# EAGLE design QuantumDice (EAGLE 7.7.0)
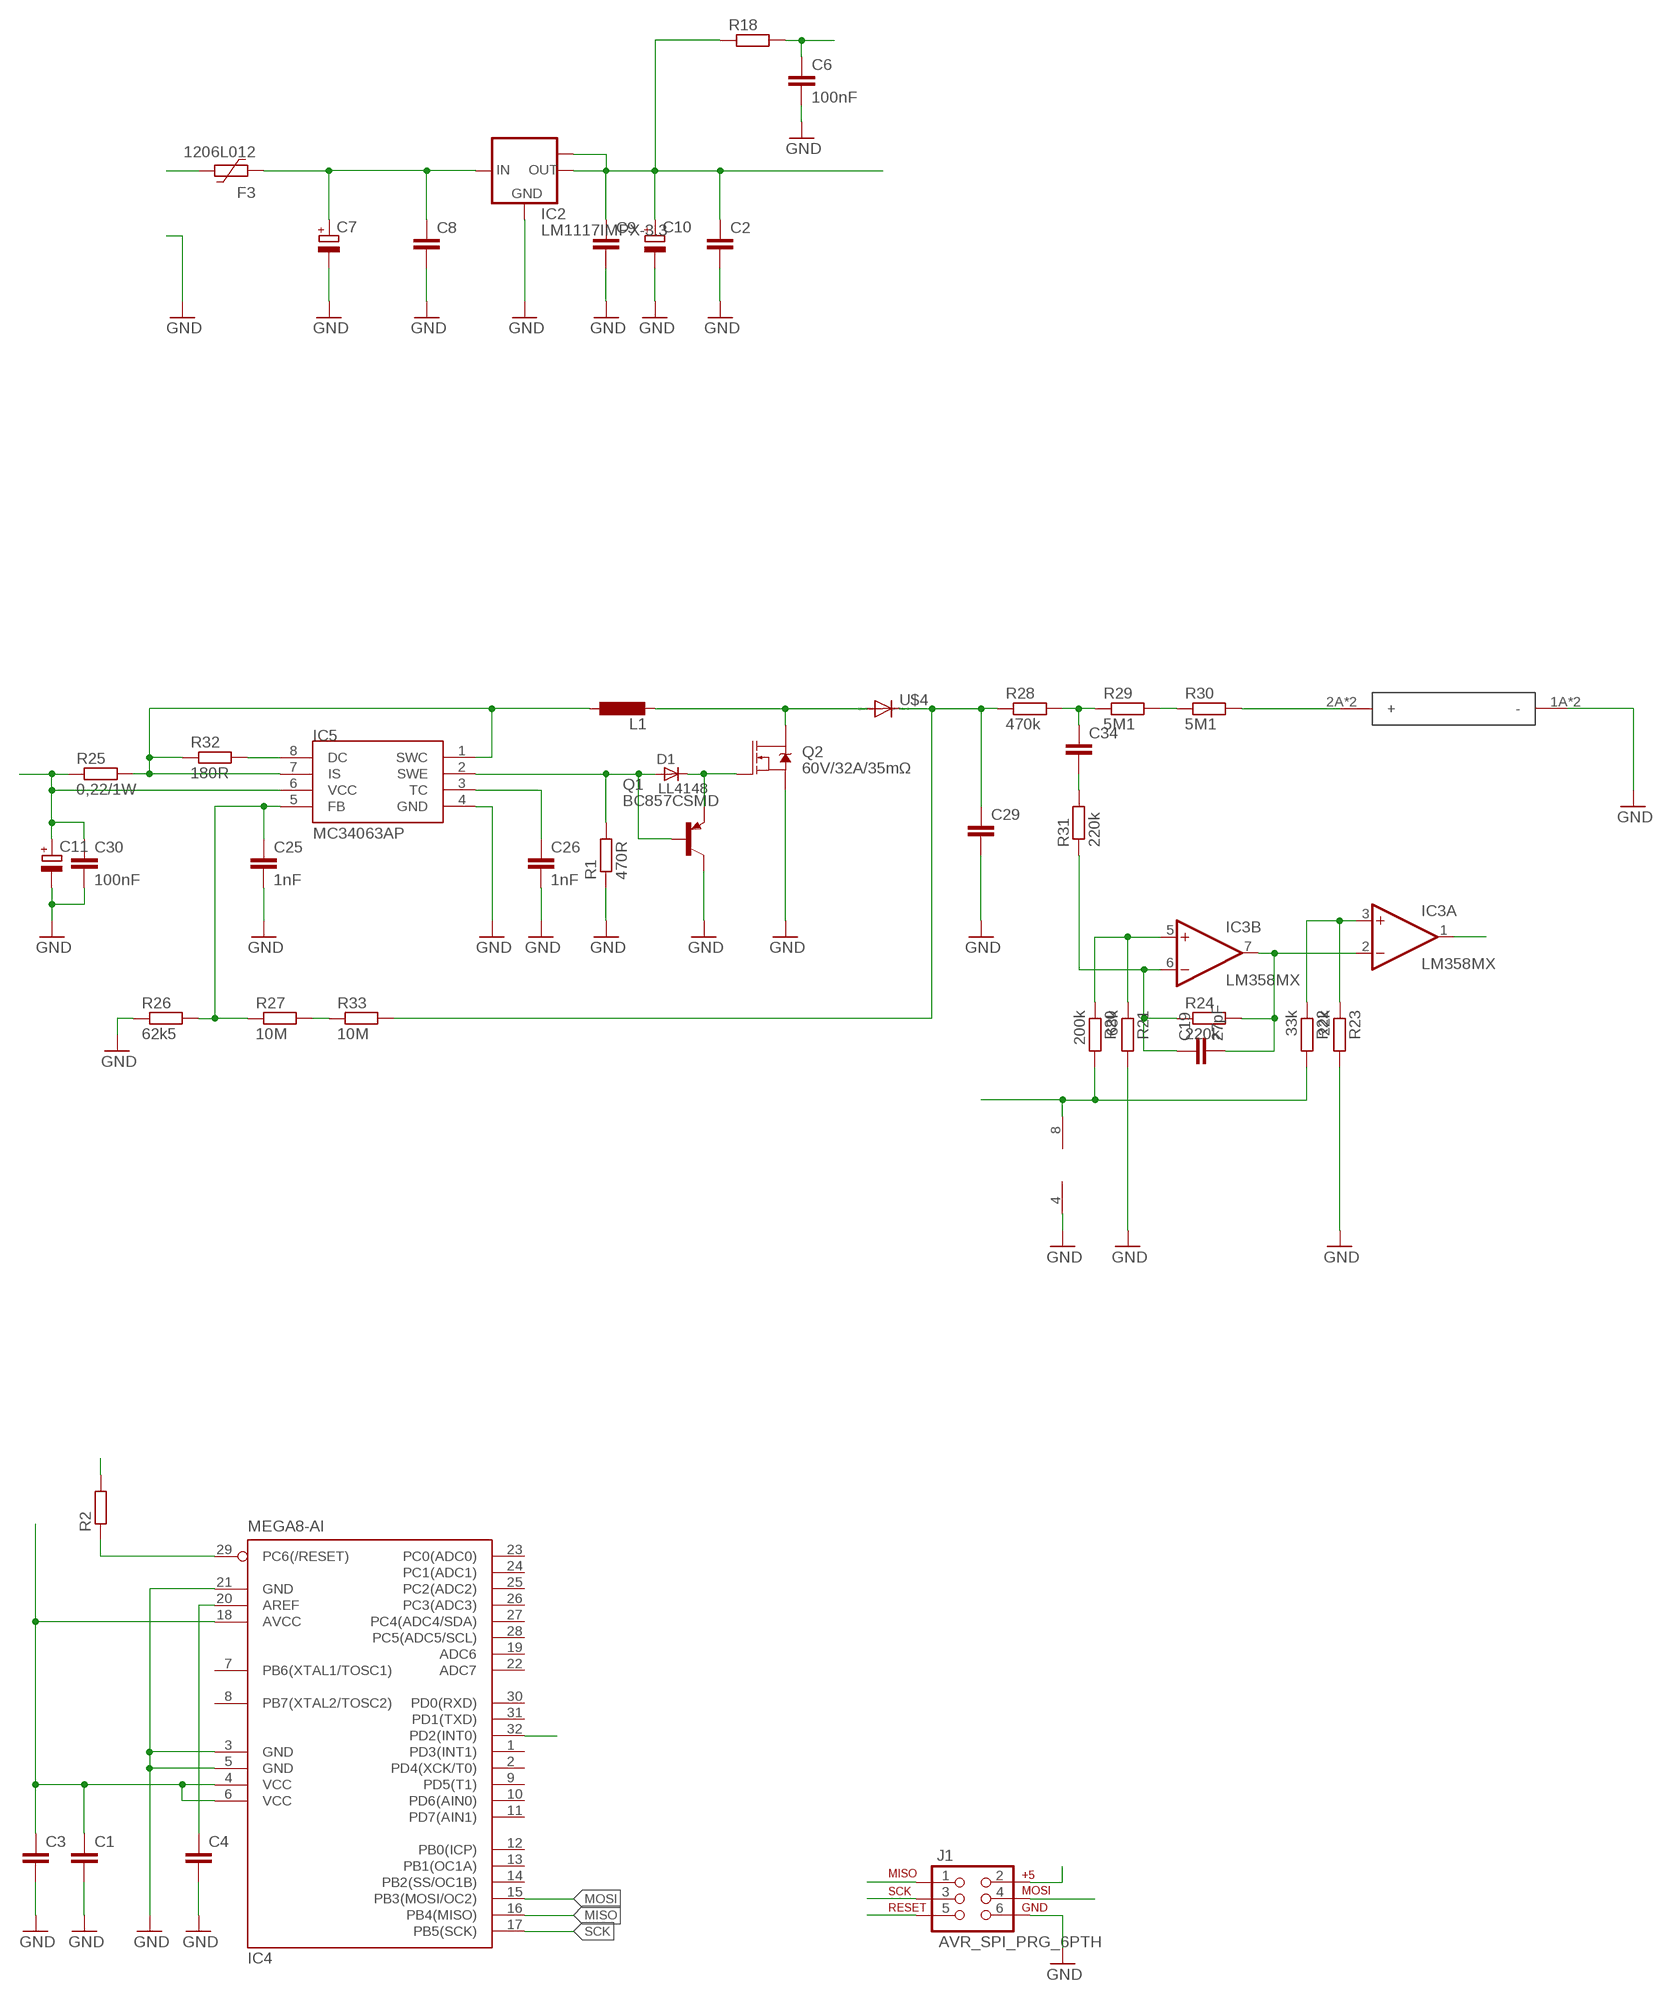
[diagram p0: schematic, sheet 1]

## Parts
C1  C-EUC0603  [C0603]
C2  C-EUC0603  [C0603]
C3  C-EUC0603  [C0603]
C4  C-EUC0603  [C0603]
C6  100nF  C-EUC0603  [C0603]
C7  CPOL-EUSMCC  [SMC_C]
C8  C-EUC1206  [C1206]
C9  C-EUC1206  [C1206]
C10  CPOL-EUSMCC  [SMC_C]
C11  CPOL-EUSMCE  [SMC_E]
C19  27pF  C-EUC0603  [C0603]
C25  1nF  C-EUC0603  [C0603]
C26  1nF  C-EUC0603  [C0603]
C29  C-EU225-113X268  [C225-113X268]
C30  100nF  C-EUC0603  [C0603]
C34  C-EU050-024X044  [C050-024X044]
D1  LL4148  [SOD80_DO213AA_MINIMELF]
F3  1206L012  [1206L]
IC2  LM1117IMPX-3.3  [SOT223]
IC3  LM358MX  [SO08]
IC4  MEGA8-AI  [TQFP32-08]
IC5  MC34063AP  [DIL08]
J1  AVR_SPI_PRG_6PTH  [2X3]
L1  L-EU6000-XXX-RC  [6000-XXXX-RC]
Q1  BC857CSMD  [SOT23-BEC]
Q2  60V/32A/35mΩ  MOSFET-NCH-FQP30N06L  [TO220V]
R1  470R  R-EU_R1206  [R1206]
R2  R-EU_R0603  [R0603]
R18  R-EU_R1206  [R1206]
R20  200k  R-EU_R0603  [R0603]
R21  68k  R-EU_R0603  [R0603]
R22  33k  R-EU_R1206  [R1206]
R23  22k  R-EU_R0603  [R0603]
R24  220k  R-EU_R0603  [R0603]
R25  0,22/1W  R-EU_R2010  [R2010]
R26  62k5  R-EU_R1206  [R1206]
R27  10M  R-EU_R2512  [R2512]
R28  470k  R-EU_R2512  [R2512]
R29  5M1  R-EU_R2512  [R2512]
R30  5M1  R-EU_R2512  [R2512]
R31  220k  R-EU_R0805  [R0805]
R32  180R  R-EU_R0805  [R0805]
R33  10M  R-EU_R2512  [R2512]
U$4  DIODE-MELF-MLL41  [MELF-MLL41]
U$5  STS5  [GEIGERTUBE]

## Nets
9V: C7.+ C8.1 C11.+ C30.1 F3.2 IC2.3(IN) IC5.6(VCC) R25.1
_5V: C1.1 C2.1 C3.1 C9.1 C10.+ IC2.2(OUT) IC2.TAB(OUT1) IC4.4(VCC) IC4.6(VCC) IC4.18(AVCC) J1.2 R2.2 R18.1
A_5V: C6.1 IC3.8(P:V+) R18.2 R20.2 R22.2
CPM: IC3.1(A:OUT) IC4.32(PD2(INT0))
GND: C1.2 C2.2 C3.2 C4.2 C6.2 C7.- C8.2 C9.2 C10.- C11.- C25.2 C26.2 C29.2 C30.2 IC2.1(GND) IC3.4(P:V-) IC4.3(GND) IC4.5(GND) IC4.21(GND) IC5.4(GND) J1.6 Q1.C Q2.3(S) R1.1 R21.2 R23.2 R26.1 U$5.1A(-) U$5.1B(-)
HV: C29.1 R28.1 R33.2 U$4.C
MISO: IC4.16(PB4(MISO)) J1.1
MOSI: IC4.15(PB3(MOSI/OC2)) J1.4
N$2: D1.A IC5.2(SWE) Q1.B R1.2
N$3: D1.C Q1.E Q2.1(G)
N$5: C19.1 IC3.6(B:-IN) R24.1 R31.1
N$6: C4.1 IC4.20(AREF)
N$8: C19.2 IC3.2(A:-IN) IC3.7(B:OUT) R24.2
N$11: C26.1 IC5.3(TC)
N$14: F3.1
N$19: IC3.5(B:+IN) R20.1 R21.1
N$20: IC3.3(A:+IN) R22.1 R23.1
N$21: L1.2 Q2.2(D) U$4.A
N$24: C25.1 IC5.5(FB) R26.2 R27.1
N$25: R30.2 U$5.2A(+) U$5.2B(+)
N$26: R29.2 R30.1
N$27: C34.1 R28.2 R29.1
N$28: C34.2 R31.2
N$33: IC5.1(SWC) IC5.7(IS) L1.1 R25.2 R32.1
N$34: IC5.8(DC) R32.2
N$35: R27.2 R33.1
RESET: IC4.29(PC6(/RESET)) J1.5 R2.1
SCK: IC4.17(PB5(SCK)) J1.3
Unconnected: IC4.1(PD3(INT1)) IC4.2(PD4(XCK/T0)) IC4.7(PB6(XTAL1/TOSC1)) IC4.8(PB7(XTAL2/TOSC2)) IC4.9(PD5(T1)) IC4.10(PD6(AIN0)) IC4.11(PD7(AIN1)) IC4.12(PB0(ICP)) IC4.13(PB1(OC1A)) IC4.14(PB2(SS/OC1B)) IC4.19(ADC6) IC4.22(ADC7) IC4.23(PC0(ADC0)) IC4.24(PC1(ADC1)) IC4.25(PC2(ADC2)) IC4.26(PC3(ADC3)) IC4.27(PC4(ADC4/SDA)) IC4.28(PC5(ADC5/SCL)) IC4.30(PD0(RXD)) IC4.31(PD1(TXD))

## Library data of the parts
C1-C4 C6 C8 C9 C19 C25 C26 C29 C30 C34 = rcl:C-EU: CAPACITOR, European symbol
C7 C10 C11 = rcl:CPOL-EU: POLARIZED CAPACITOR, European symbol
D1 = _hhn_diodes_smd:LL4148: 1N4148 General Purpose Rectifie SMD-Version of 1N4148 Case: SOD 80 = DO 213 AA = MINIMELF (Glass) Author: Dipl.-Ing. FH Rainer Bayer HHN Hochschule Heilbronn, rainer.bayer@hs-heilbronn.de Ingenieurbüro ing-rb, mail@ing-rb.de
F3 = polyfuse-smd_10:?: Polyfuse Resettable PTC Source: http://www.littelfuse.com/products/resettable-ptcs.aspx; MF: Littelfuse; MPN: 1206L012; OC_FARNELL: 1596988; OC_NEWARK: 05M2298
IC2 = lm1117:LM1117IMPX-*
IC3 = linear:LM358: OP AMP also LM158; LM258; LM2904 Source: http://cache.national.com/ds/LM/LM158.pdf
IC4 = atmel:MEGA8: MICROCONTROLLER 8 Kbytes FLASH, 1 kbytes SRAM, 512 bytes EEPROM, USART, 6-channel 10 bit ADC, 2-channel 8 bit ADC Pin compatible with Atmega48, ATMega88, ATMega168 Source: avr.lbr; MPN: ATMEGA8-16AU; OC_FARNELL: 9171371; OC_NEWARK: 73M8863
IC5 = mc34063:MC34063
J1 = SparkFun-Connectors:AVR_SPI_PRG_6: AVR ISP 6 Pin This is the reduced ISP connector for AVR programming. Common on Arduino. This footprint will take up less PCB space and can be used with a 10-pin to 6-pin adapter such as SKU: BOB-08508
L1 = rcl:L-EU: INDUCTOR, European symbol
Q1 = transistor-pnp:BC857*: PNP Transistror
Q2 = SparkFun-DiscreteSemi:MOSFET-NCH: N-channel MOSFETs Voltage controlled devices that allow control of high current outputs. SparkFun Products: SparkFun OpenScale <https://www.sparkfun.com/products/13261> SparkFun Digital Sandbox <https://www.sparkfun.com/products/12651> SparkFun Monster Moto Shield <https://www.sparkfun.com/products/10182> SparkFun MOSFET Power Controller <https://www.sparkfun.com/products/11214>; PROD_ID: TRANS-10060
R1 R2 R18 R20-R33 = rcl:R-EU_: RESISTOR, European symbol
U$4 = diode:DIODE-: DIODE
U$5 = mw:STS5

## Board
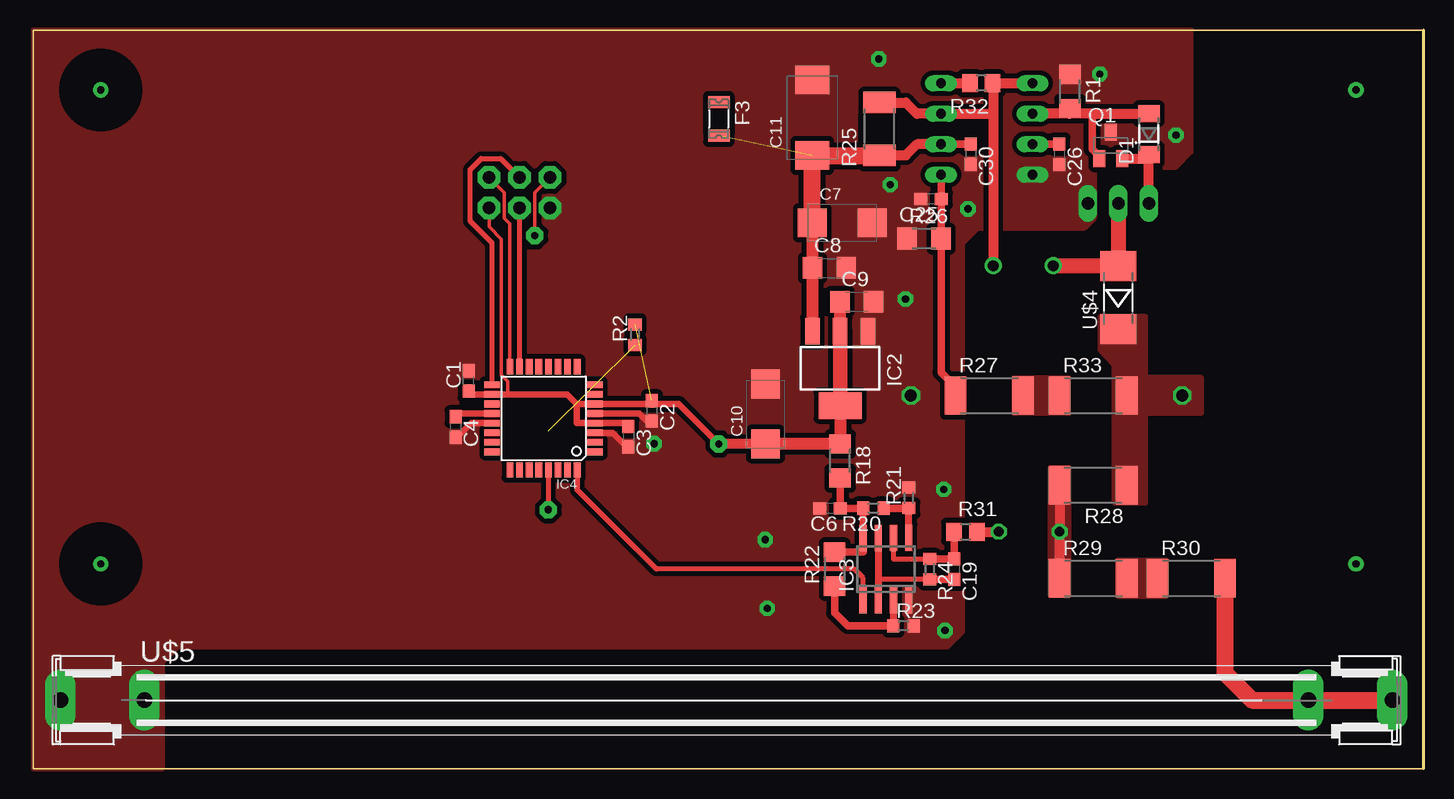
[diagram p1: board, top side]
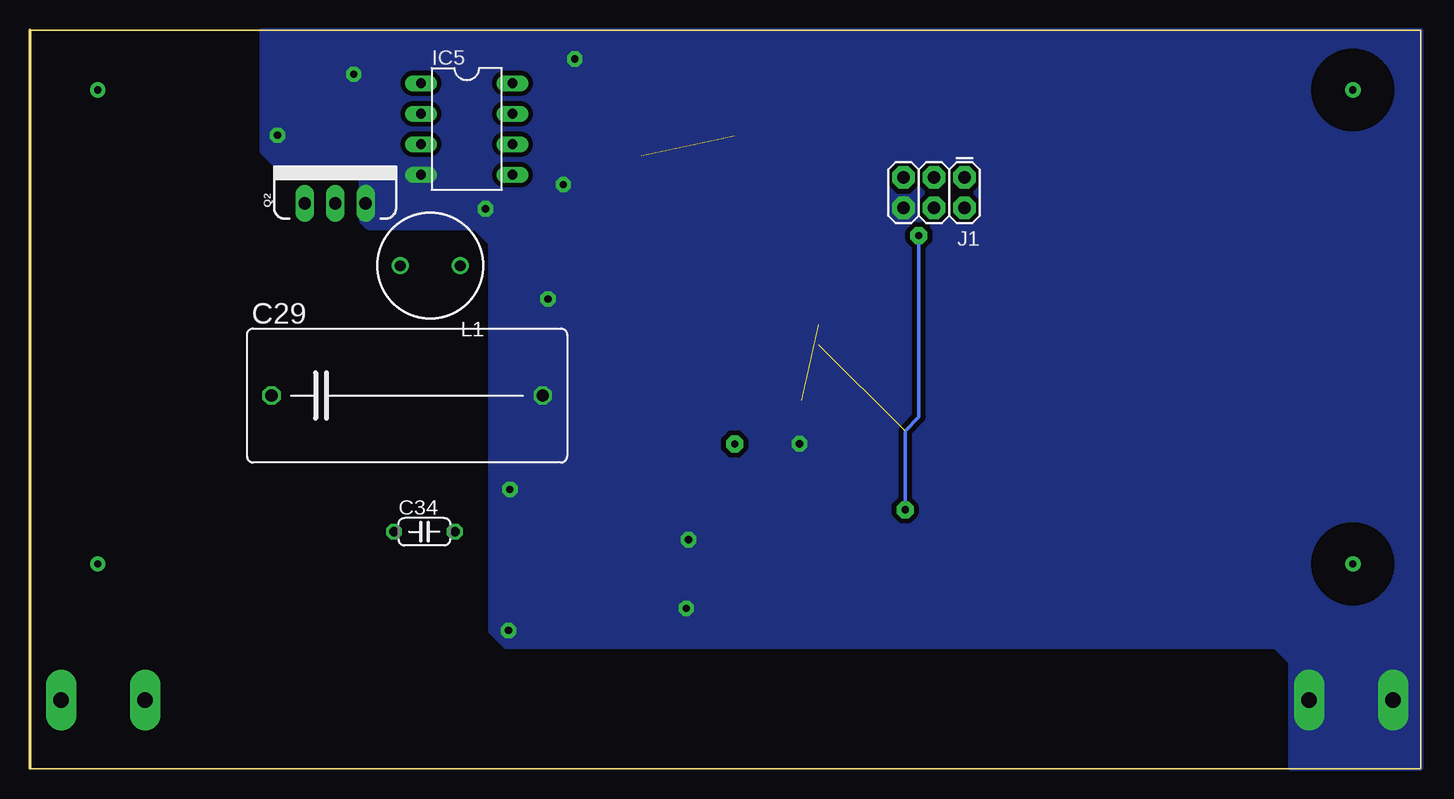
[diagram p2: board, bottom side, seen from below]

Size 115.88 x 61.6 mm. Coordinates in mm from the lower left corner, seen from the top.
Outline: 0,0 115.88,0 115.88,61.6 0,61.6 0,0
Copper layers (1*16): Top 0.035mm / dielectric 1.5mm / Bottom 0.035mm
Design rules "default *": minimum track width 10mil, minimum drill 24mil, track to track 8mil, track to pad 8mil, pad to pad 8mil, via to via 8mil, smd to smd 8mil, copper to edge 0mil, drill to drill 8mil, minimum pad ring 10mil, minimum via ring 8mil, stop-mask expansion 4mil, vias tented up to drill 0mil, thermal gap 10mil
tRestrict: area 2.6,14 to 8.7,20.1; area 2.6,53.5 to 8.7,59.6
bRestrict: area 2.6,14 to 8.7,20.1; area 2.6,53.5 to 8.7,59.6

### Footprints (pad centres in the part's own frame; a part is rotated, then mirrored left to right if it is on the bottom)
C0603 = smd 1.1 x 1: 1 -0.85,0; 2 0.85,0
SMC_C = smd 2.4 x 2.4: + -2.5,0; - 2.5,0
C1206 = smd 1.6 x 1.8: 1 -1.4,0; 2 1.4,0
SMC_E = smd 2.4 x 2.8: + -3.15,0; - 3.15,0
C225-113X268 = drill 1.016 octagon: 1 -11.303,0; 2 11.303,0
C050-024X044 = drill 0.813 octagon: 1 -2.54,0; 2 2.54,0
SOD80_DO213AA_MINIMELF = smd 1.4 x 1.8: A 1.7,0; C -1.7,0
1206L = smd 1 x 1.8: 1 -1.4,0; 2 1.4,0
SOT223 = smd 1.219 x 2.235: 1 -2.311,-3.099; 2 0,-3.099; 3 2.311,-3.099 | smd 3.6 x 2.2: TAB 0,3.099
SO08 = smd 0.6 x 2.2: 1 -1.905,-2.6; 2 -0.635,-2.6; 3 0.635,-2.6; 4 1.905,-2.6; 5 1.905,2.6; 6 0.635,2.6; 7 -0.635,2.6; 8 -1.905,2.6
TQFP32-08 = smd 1.27 x 0.559: 1 -4.293,2.8; 2 -4.293,2; 3 -4.293,1.2; 4 -4.293,0.4; 5 -4.293,-0.4; 6 -4.293,-1.2; 7 -4.293,-2; 8 -4.293,-2.8; 17 4.293,-2.8; 18 4.293,-2; 19 4.293,-1.2; 20 4.293,-0.4; 21 4.293,0.4; 22 4.293,1.2; 23 4.293,2; 24 4.293,2.8 | smd 0.559 x 1.27: 9 -2.8,-4.293; 10 -2,-4.293; 11 -1.2,-4.293; 12 -0.4,-4.293; 13 0.4,-4.293; 14 1.2,-4.293; 15 2,-4.293; 16 2.8,-4.293; 25 2.8,4.293; 26 2,4.293; 27 1.2,4.293; 28 0.4,4.293; 29 -0.4,4.293; 30 -1.2,4.293; 31 -2,4.293; 32 -2.8,4.293
DIL08 = drill 0.813 long: 1 -3.81,-3.81; 2 -1.27,-3.81; 3 1.27,-3.81; 4 3.81,-3.81; 5 3.81,3.81; 6 1.27,3.81; 7 -1.27,3.81; 8 -3.81,3.81
2X3 = drill 1.016 pad 1.88 octagon: 1 0,0; 2 0,2.54; 3 2.54,0; 4 2.54,2.54; 5 5.08,0; 6 5.08,2.54
6000-XXXX-RC = drill 0.9 pad 1.422: 1 -2.5,0; 2 2.5,0
SOT23-BEC = smd 1 x 1.4: B -0.95,-1.1; C 0,1.1; E 0.95,-1.1
TO220V = drill 1.016 long: 1 -2.54,0; 2 0,0; 3 2.54,0
R1206 = smd 1.6 x 1.803: 1 -1.422,0; 2 1.422,0
R0603 = smd 1 x 1.1: 1 -0.85,0; 2 0.85,0
R2010 = smd 1.8 x 2.7: 1 -2.2,0; 2 2.2,0
R2512 = smd 1.8 x 3.2: 1 -2.8,0; 2 2.8,0
R0805 = smd 1.3 x 1.5: 1 -0.95,0; 2 0.95,0
MELF-MLL41 = smd 2.5 x 3: A 2.625,0; C -2.625,0
GEIGERTUBE = drill 1.321 pad 2.54 long: 1A -10.414,0; 1B -3.414,0; 2A 93.586,0; 2B 100.586,0

### Placement (x,y rotation side)
C1  36.3,32.33 90 top
C2  51.56,29.83 270 top
C3  49.61,27.69 270 top
C4  35.2,28.49 270 top
C6  66.42,21.72 180 top
C7  67.44,45.52 0 top
C8  66.36,41.76 0 top
C9  68.64,38.94 0 top
C10  61.04,29.57 90 top
C11  64.94,54.28 90 top
C19  76.76,16.64 270 top
C25  74.83,47.5 180 top
C26  85.52,51.22 270 top
C29  84.45,31.11 0 bottom
C30  78.13,51.23 270 top
C34  83.01,19.76 0 bottom
D1  92.99,52.91 90 top
F3  57.15,54.18 270 top
IC2  67.26,33.38 180 top
IC3  71.07,16.64 0 top
IC4  42.55,29.21 180 top
IC5  79.48,53.34 270 bottom
J1  38,49.3 180 bottom
L1  82.52,41.94 180 bottom
Q1  89.81,51.97 0 top
Q2  90.45,47.14 0 bottom
R1  86.41,56.46 270 top
R2  50.17,36.2 90 top
R18  67.26,25.65 270 top
R20  70.03,21.72 180 top
R21  72.97,22.58 90 top
R22  66.8,16.64 90 top
R23  72.54,11.91 0 top
R24  74.73,16.64 270 top
R25  70.54,53.34 90 top
R26  74.24,44.2 0 top
R27  79.68,31.11 0 top
R28  88.34,23.62 180 top
R29  88.34,15.88 0 top
R30  96.52,15.88 0 top
R31  77.7,19.76 0 top
R32  79.02,57.15 180 top
R33  88.34,31.11 0 top
U$4  90.42,39.27 90 top
U$5  12.7,5.71 0 top

### Tracks (layer width: path | path; a pad name or v marks a point on that pad's centre or on a via)
9V  (1 unrouted)
  Top 0.61: IC2.3 | IC5.6 C30.1
  Top 0.813: IC5.6 73.66,52.07 72.73,51.14 R25.1 | 64.94,36.49 IC2.3
  Top 1.016: C7.+ 64.94,41.91 | 64.94,41.91 64.94,36.48 IC2.3 | C8.1 64.96,41.89 64.94,41.91
  Top 1.422: 65.39,51.14 C11.+ | C11.+ 70.53,51.13 R25.1 | C7.+ C11.+
_5V  (via drill 0.6 pad 1.42)  (1 unrouted)
  Top 0.305: 39.54,31.21 39.54,32.29 39.01,32.82 39.01,44.17 38,45.19 J1.2
  Top 0.559: C1.1 36.3,31.21 IC4.18 39.54,31.21 44.51,31.21 45.31,30.41 | C3.1 49.61,28.81 IC4.4 45.31,28.81 45.31,30.41 | 45.31,30.41 IC4.6 51.56,30.41 | 51.56,30.41 C2.1 | 51.56,30.41 53.82,30.41 v57.15,27.08
  Top 0.61: IC2.TAB
  Top 0.813: C10.+ v57.15,27.08
  Top 1.016: IC2.TAB R18.1 C10.+ | IC2.2 67.26,38.92 C9.1
  Top 1.219: IC2.TAB IC2.2
  Top 1.27: IC2.TAB
A_5V
  Top 0.599: IC3.8 69.16,21.7 R20.2
  Top 0.61: R18.2 67.26,21.73 C6.1 R20.2 | R22.2 69.16,18.06 IC3.8
CPM
  Top 0.305: IC3.1
  Top 0.406: IC3.1 69.16,15.9 68.43,16.64 51.94,16.64 45.35,23.23 IC4.32
GND  (via drill 0.6 pad 1.27)
  Top 0.559: C4.2 35.34,27.64 36.51,28.81 IC4.21 | IC4.3 48.29,28.01 49.46,26.84 C3.2 | IC4.5 50.53,29.61 51.15,28.98 C2.2
  other vias: 61.19,13.38 61.01,19.09 71.44,48.69 70.48,59.18 76,11.52 95.25,52.83 77.92,46.69 88.9,57.91 72.71,39.17 75.88,23.29 51.75,27.1
  pour Top (isolate 0.406, rank 2, no thermals): 0,61.6 0,0 10.79,0 10.79,8.89 12.06,10.16 76.2,10.16 77.47,11.43 77.47,43.82 78.74,45.09 87.63,45.09 88.47,45.92 88.47,50.17 95.25,50.17 96.52,51.44 96.52,61.6
  pour Bottom (isolate 0.406, no thermals): 0,61.6 0,0 10.79,0 10.79,8.89 12.06,10.16 76.2,10.16 77.47,11.43 77.47,43.82 78.74,45.09 87.63,45.09 88.27,45.72 88.27,49.53 88.9,50.17 95.25,50.17 96.52,51.44 96.52,61.6
HV
  pour Top (isolate 0.406, no thermals): 97.38,32.61 92.74,32.61 92.74,37.69 88.9,37.69 88.9,34.93 90.07,33.66 90.07,22.17 92.74,22.17 92.74,29.64 97.38,29.64
MISO
  Top 0.305: IC4.16 39.75,45.45 39.27,45.92 39.27,48.03 J1.1
MOSI
  Top 0.406: IC4.15 J1.4
N$1
  cutout Top: 55.84,56.08 55.84,52.91 58.46,52.91 58.46,56.08
N$2
  Top 0.406: Q1.B 88.86,51.06
  Top 0.61: 88.86,51.06 88.27,51.66 88.27,54.61
  Top 0.813: D1.A 88.27,54.61 86.36,54.61 | 86.36,54.61 IC5.2 | IC5.2 | R1.2 86.41,54.66 86.36,54.61
N$3
  Top 0.61: 92.98,50.87 D1.C
  Top 0.813: Q2.1 D1.C 92.65,50.87 Q1.E
N$5
  Top 0.406: IC3.6 71.7,17.49 R24.1
  Top 0.61: R24.1 C19.1 R31.1
N$6
  Top 0.559: IC4.20 35.2,29.61 C4.1
N$8
  Top 0.406: R24.2 70.43,15.79
  Top 0.599: IC3.7 70.43,15.79 IC3.2
  Top 0.61: C19.2 R24.2
N$11
  Top 0.61: IC5.3 C26.1
N$14
  Top 0.399: 57.13,55.6 F3.1
  Top 0.813: 57.25,55.58 F3.1
N$19
  Top 0.599: IC3.5 R21.1
  Top 0.61: R20.1 72.96,21.72 R21.1
N$20
  Top 0.599: IC3.3 71.7,11.92 R23.1
  Top 0.61: R23.1 67.89,11.91 66.8,13 R22.1
N$21
  Top 1.27: Q2.2 90.45,41.92 U$4.A 90.38,41.94 L1.2
N$24
  Top 0.406: 76.83,31.13 R27.1
  Top 0.61: 76.83,31.13 76.83,31.88 75.67,33.05 75.67,44.45 | IC5.5 75.67,47.62 | 75.67,47.62 75.67,44.45 | C25.1 75.68,47.61 75.67,47.62 | R26.2 75.67,44.45
N$25
  Top 1.422: R30.2 99.32,7.99 101.6,5.71 U$5.2A U$5.2B
N$26
  pour Top (isolate 0.406, no thermals): 90.4,17.37 90.4,14.38 94.46,14.38 94.46,17.37
N$27
  Top 0.813: R28.2 C34.1 R29.1
  pour Top (no thermals): 84.79,25.1 86.31,25.1 86.31,14.4 84.79,14.4
N$28
  Top 0.813: R31.2 C34.2
N$32
  cutout Top: 68.78,52.04 72.29,52.04 72.29,54.64 68.78,54.64
N$33
  Top 0.61: 80.01,57.11 R32.1
  Top 0.813: 80.01,54.61 IC5.7 73.66,54.61 72.73,55.54 R25.2 | R32.1 IC5.1 | 80.01,57.11 80.01,54.61 | 80.01,54.61 L1.1
N$34
  Top 0.813: IC5.8 R32.2
N$35
  pour Top (isolate 0.406, no thermals): 81.71,32.59 81.71,29.64 86.31,29.64 86.31,32.59
N$36  (via drill 0.6 pad 1.27)
  other vias: 5.63,56.6
N$37  (via drill 0.6 pad 1.27)
  other vias: 5.63,17.07
N$38  (via drill 0.6 pad 1.27)
  other vias: 110.24,17.07
N$39  (via drill 0.6 pad 1.27)
  other vias: 110.24,56.6
RESET  (via drill 0.6 pad 1.42)  (1 unrouted)
  Top 0.305: J1.5 41.81,48.03 v41.81,44.45
  Top 0.406: IC4.29 v42.95,21.59
  Bottom 0.305: v41.81,44.45 41.81,29.31 42.95,28.18 v42.95,21.59
SCK
  Top 0.406: IC4.17 38.25,43.84 36.42,45.67 36.42,49.96 37.34,50.88 38.96,50.88 J1.3